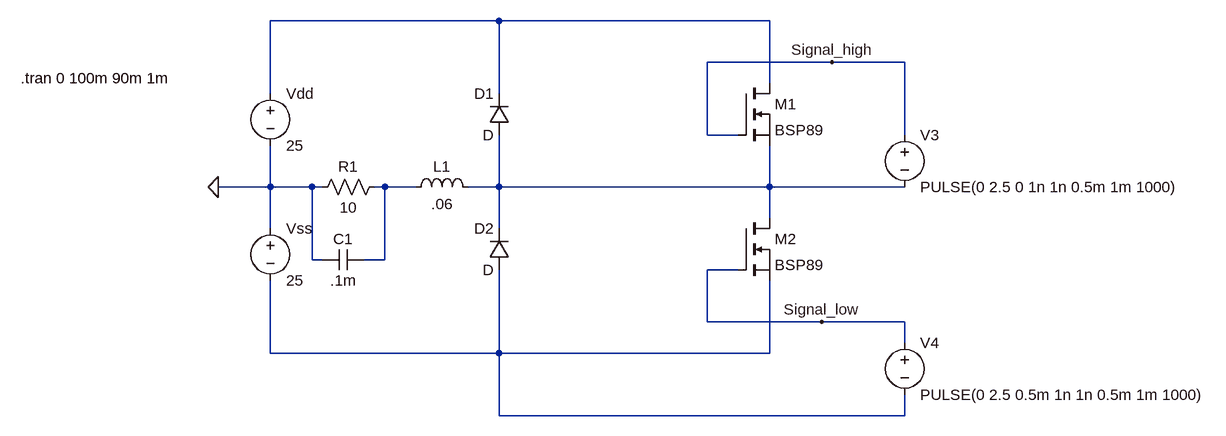
[diagram p0: schematic Angel_single_MOS.asc]
Angel_single_MOS.asc, the LTspice schematic file:
Version 4
SHEET 1 1644 920
WIRE 544 80 192 80
WIRE 960 80 544 80
WIRE 1056 144 864 144
WIRE 1168 144 1056 144
WIRE 960 176 960 80
WIRE 192 192 192 80
WIRE 544 192 544 80
WIRE 864 256 864 144
WIRE 912 256 864 256
WIRE 1168 256 1168 144
WIRE 192 336 192 272
WIRE 192 336 112 336
WIRE 256 336 192 336
WIRE 272 336 256 336
WIRE 368 336 352 336
WIRE 416 336 368 336
WIRE 544 336 544 256
WIRE 544 336 496 336
WIRE 960 336 960 272
WIRE 960 336 544 336
WIRE 1168 336 960 336
WIRE 960 384 960 336
WIRE 192 400 192 336
WIRE 544 400 544 336
WIRE 256 448 256 336
WIRE 272 448 256 448
WIRE 368 448 368 336
WIRE 368 448 336 448
WIRE 912 464 864 464
WIRE 864 544 864 464
WIRE 1040 544 864 544
WIRE 1168 544 1040 544
WIRE 1168 576 1168 544
WIRE 192 592 192 480
WIRE 544 592 544 464
WIRE 544 592 192 592
WIRE 960 592 960 480
WIRE 960 592 544 592
WIRE 544 688 544 592
WIRE 1168 688 1168 656
WIRE 1168 688 544 688
FLAG 112 336 0
FLAG 1040 544 Signal_low
FLAG 1056 144 Signal_high
SYMBOL voltage 192 176 R0
SYMATTR InstName Vdd
SYMATTR Value 25
SYMBOL voltage 192 384 R0
SYMATTR InstName Vss
SYMATTR Value 25
SYMBOL Diode 560 256 R180
WINDOW 0 24 64 Left 2
WINDOW 3 24 0 Left 2
SYMATTR InstName D1
SYMBOL Diode 560 464 R180
WINDOW 0 24 64 Left 2
WINDOW 3 24 0 Left 2
SYMATTR InstName D2
SYMBOL voltage 1168 240 R0
SYMATTR InstName V3
SYMATTR Value PULSE(0 2.5 0 1n 1n 0.5m 1m 1000)
SYMBOL voltage 1168 560 R0
SYMATTR InstName V4
SYMATTR Value PULSE(0 2.5 0.5m 1n 1n 0.5m 1m 1000)
SYMBOL Res 368 320 R90
WINDOW 0 0 56 VBottom 2
WINDOW 3 32 56 VTop 2
SYMATTR InstName R1
SYMATTR Value 10
SYMBOL nmos 912 384 R0
SYMATTR InstName M2
SYMATTR Value BSP89
SYMBOL nmos 912 176 R0
SYMATTR InstName M1
SYMATTR Value BSP89
SYMBOL Cap 336 432 R90
WINDOW 0 0 32 VBottom 2
WINDOW 3 32 32 VTop 2
SYMATTR InstName C1
SYMATTR Value .1m
SYMBOL Ind 400 352 R270
WINDOW 0 32 56 VTop 2
WINDOW 3 5 56 VBottom 2
SYMATTR InstName L1
SYMATTR Value .06
TEXT -192 168 Left 2 !.tran 0 100m 90m 1m

The netlist it stands for:
* Angel_single_MOS.asc
Vdd N001 0 25
Vss 0 N004 25
D1 N003 N001 D
D2 N004 N003 D
V3 Signal_high N003 PULSE(0 2.5 0 1n 1n 0.5m 1m 1000)
V4 Signal_low N004 PULSE(0 2.5 0.5m 1n 1n 0.5m 1m 1000)
R1 N002 0 10
M2 N003 Signal_low N004 N004 BSP89
M1 N001 Signal_high N003 N003 BSP89
C1 N002 0 .1m
L1 N002 N003 .06
.model D D
.lib standard.dio
.model NMOS NMOS
.model PMOS PMOS
.lib standard.mos
.tran 0 100m 90m 1m
.backanno
.end